# Altium schematic sheet MCU152A_XDS110_MCU.SchDoc
size 431 x 279 mm; Date: Not shown in title block; ApprovedBy: Not shown in title block; CheckedBy: Not shown in title block; Author: Not shown in title block; CompanyName: Not shown in title block; Engineer: Not shown in title block; Organization: Not shown in title block; Address1: Not shown in title block; Address2: Not shown in title block; Address3: Not shown in title block; Address4: Not shown in title block; DocumentNumber: 7; Revision: Use project parameter SCH_Rev; SheetNumber: 7; SheetTotal: 8; PageSetup: Record=PageOptions|CenterHorizontal=True|CenterVertical=True|PrintScale=1.00|XCorrection=1.00|YCorrection=1.00|PrintKind=0|BorderSize=5000000|LeftOffset=0|BottomOffset=0|Orientation=2|PaperLength=1000|PaperWidth=1000|Scale=100|PaperSource=15|PrintQuality=600|MediaType=1|DitherType=10|PaperKind=Letter|PrintScaleMode=1; CurrentTime: Not shown in title block; CurrentDate: Not shown in title block; Time: Not shown in title block; DocumentFullPathAndName: Not shown in title block; DocumentName: Not shown in title block; ModifiedDate: Not shown in title block; ImagePath: Not shown in title block
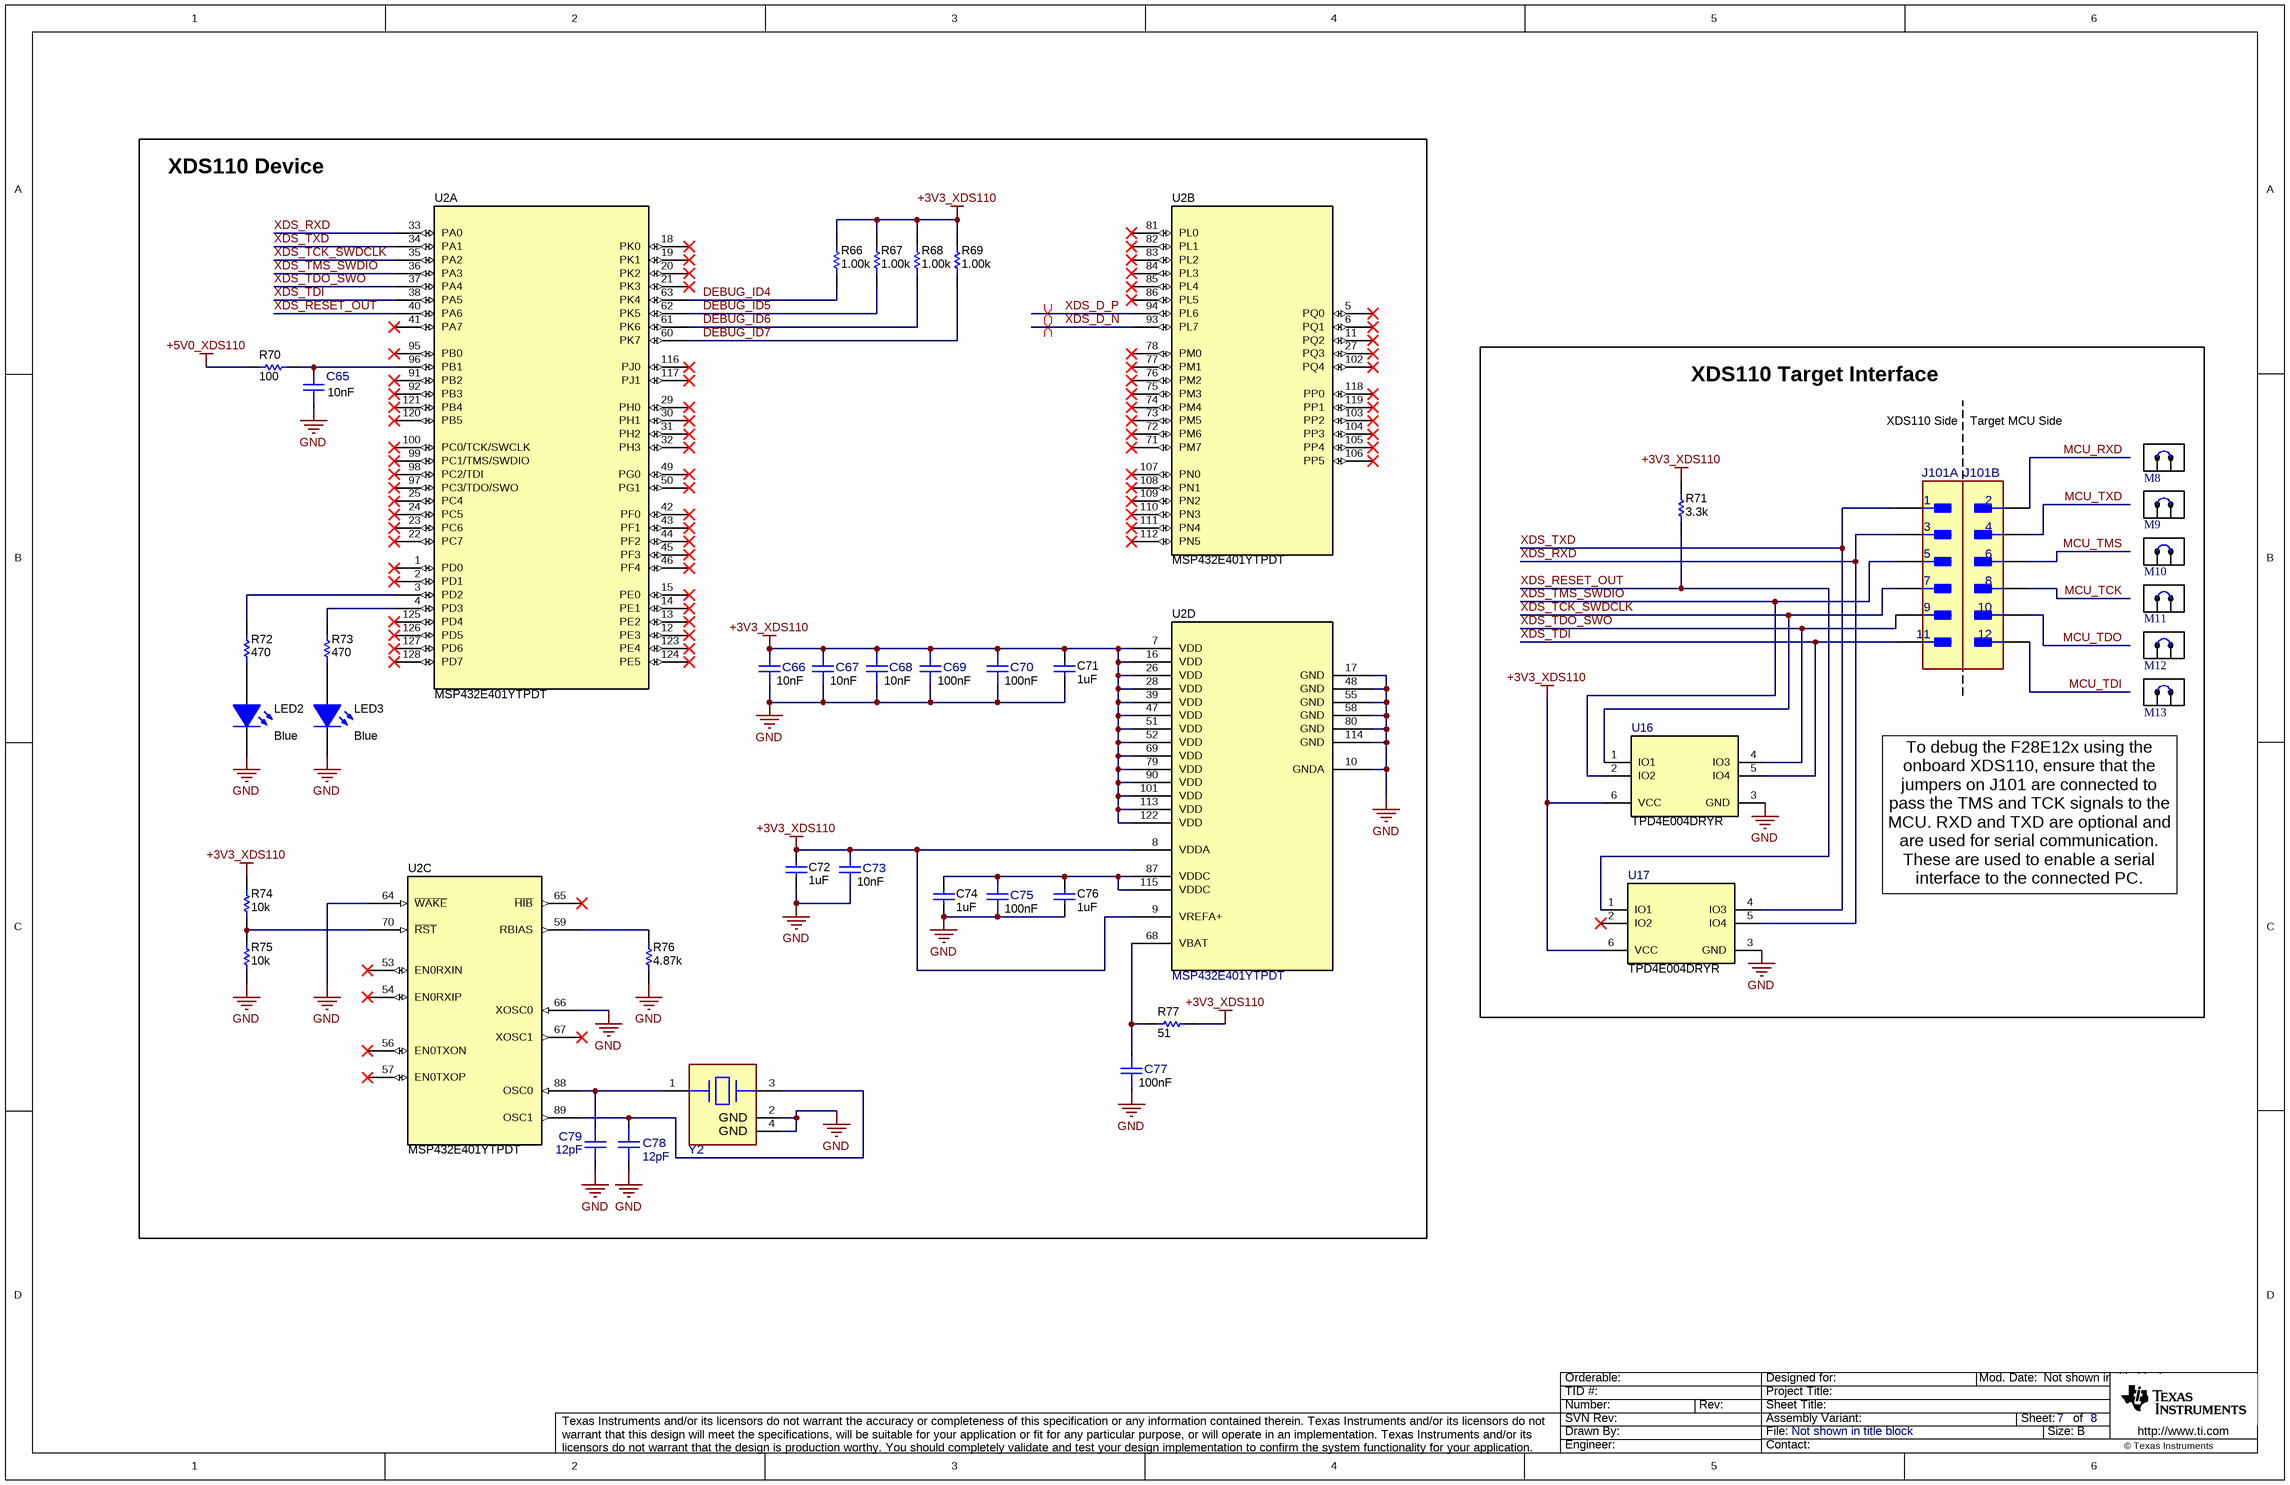
[diagram p0: MCU152A_XDS110_MCU.SchDoc]

## Parts
C65  Cap_F: 10nF  [FP-885012205050_0402-MFG]  (hidden comment: 885012205050)
C66  Cap_F: 10nF  [FP-885012205050_0402-MFG]  (hidden comment: 885012205050)
C67  Cap_F: 10nF  [FP-885012205050_0402-MFG]  (hidden comment: 885012205050)
C68  Cap_F: 10nF  [FP-885012205050_0402-MFG]  (hidden comment: 885012205050)
C69  Cap_F: 100nF  [FP-885012205018_0402-MFG]  (hidden comment: 885012205018)
C70  Cap_F: 100nF  [FP-885012205018_0402-MFG]  (hidden comment: 885012205018)
C71  ValueDisplayed: 1uF  [0402]  (hidden comment: 885012105012)
C72  ValueDisplayed: 1uF  [0402]  (hidden comment: 885012105012)
C73  Cap_F: 10nF  [FP-885012205050_0402-MFG]  (hidden comment: 885012205050)
C74  ValueDisplayed: 1uF  [0402]  (hidden comment: 885012105012)
C75  Cap_F: 100nF  [FP-885012205018_0402-MFG]  (hidden comment: 885012205018)
C76  ValueDisplayed: 1uF  [0402]  (hidden comment: 885012105012)
C77  Cap_F: 100nF  [FP-885012205018_0402-MFG]  (hidden comment: 885012205018)
C78  ValueDisplayed: 12pF  [FP-885392005127_0402-MFG]  (hidden comment: 885392005127)
C79  ValueDisplayed: 12pF  [FP-885392005127_0402-MFG]  (hidden comment: 885392005127)
J101  61301221121  [FP-61301221121_HDR12-MFG]  (value not drawn)  (parts A,B of 2)
LED2  value Blue  [WL-SMCW_Blue_0805]  (hidden comment: 150080BS75000)
LED3  value Blue  [WL-SMCW_Blue_0805]  (hidden comment: 150080BS75000)
M8  60900213421  [Wurth_60900213421]  (value not drawn)
M9  60900213421  [Wurth_60900213421]  (value not drawn)
M10  60900213421  [Wurth_60900213421]  (value not drawn)
M11  60900213421  [Wurth_60900213421]  (value not drawn)
M12  60900213421  [Wurth_60900213421]  (value not drawn)
M13  60900213421  [Wurth_60900213421]  (value not drawn)
R66  ValueDisplayed: 1.00k  [0402]  (hidden comment: CRCW04021K00FKED)
R67  ValueDisplayed: 1.00k  [0402]  (hidden comment: CRCW04021K00FKED)
R68  ValueDisplayed: 1.00k  [0402]  (hidden comment: CRCW04021K00FKED)
R69  ValueDisplayed: 1.00k  [0402]  (hidden comment: CRCW04021K00FKED)
R70  ValueDisplayed: 100  [0402]  (hidden comment: CRCW0402100RJNED)
R71  ValueDisplayed: 3.3k  [0402]  (hidden comment: CRCW04023K30JNED)
R72  ValueDisplayed: 470  [0402]  (hidden comment: RC0402FR-07470RL)
R73  ValueDisplayed: 470  [0402]  (hidden comment: RC0402FR-07470RL)
R74  ValueDisplayed: 10k  [0402]  (hidden comment: CRCW040210K0JNED)
R75  ValueDisplayed: 10k  [0402]  (hidden comment: CRCW040210K0JNED)
R76  ValueDisplayed: 4.87k  [0402]  (hidden comment: CRCW04024K87FKED)
R77  ValueDisplayed: 51  [0402]  (hidden comment: CRCW040251R0JNED)
U2  MSP432E401YTPDT  [PDT0128A]  (parts A,B,C,D of 4)
U16  TPD4E004DRYR  [DRY0006A]
U17  TPD4E004DRYR  [DRY0006A]
Y2  830064296  [FP-830064296_SMT4_3MM4_2MM7-MFG]  (value not drawn)

## Blocks framed on the sheet
XDS110 Device: C65-C79 LED2 LED3 R66-R70 R72-R77 U2 Y2
XDS110 Target Interface: J101 M8-M13 R71 U16 U17

## Nets
+3V3_XDS110: C66.2 C67.2 C68.2 C69.2 C70.2 C71.1 C72.1 C73.2 R66.2 R67.2 R68.2 R69.2 R71.2 R74.2 R77.2 U2.7(VDD) U2.8(VDDA) U2.9(VREFA+) U2.16(VDD) U2.26(VDD) U2.28(VDD) U2.39(VDD) U2.47(VDD) U2.51(VDD) U2.52(VDD) U2.69(VDD) U2.79(VDD) U2.90(VDD) U2.101(VDD) U2.113(VDD) U2.122(VDD) U16.6(VCC) U17.6(VCC)
+5V0_XDS110: R70.1
GND: C65.1 C66.1 C67.1 C68.1 C69.1 C70.1 C71.2 C72.2 C73.1 C74.2 C75.1 C76.2 C77.1 C78.2 C79.2 LED2.1(K) LED3.1(K) R75.1 R76.1 U2.10(GNDA) U2.17(GND) U2.48(GND) U2.55(GND) U2.58(GND) U2.64(~{WAKE}) U2.66(XOSC0) U2.80(GND) U2.114(GND) U16.3(GND) U17.3(GND) Y2.2(GND) Y2.4(GND)
DEBUG_ID4: R66.1 U2.63(PK4)
DEBUG_ID5: R67.1 U2.62(PK5)
DEBUG_ID6: R68.1 U2.61(PK6)
DEBUG_ID7: R69.1 U2.60(PK7)
MCU_RXD: J101.2
MCU_TCK: J101.8
MCU_TDI: J101.12
MCU_TDO: J101.10
MCU_TMS: J101.6
MCU_TXD: J101.4
XDS_D_N: U2.93(PL7)
XDS_D_P: U2.94(PL6)
XDS_RESET_OUT: R71.1 U2.40(PA6) U17.1(IO1)
XDS_RXD: J101.3 U2.33(PA0) U17.5(IO4)
XDS_TCK_SWDCLK: J101.7 U2.35(PA2) U16.1(IO1)
XDS_TDI: J101.11 U2.38(PA5) U16.5(IO4)
XDS_TDO_SWO: J101.9 U2.37(PA4) U16.4(IO3)
XDS_TMS_SWDIO: J101.5 U2.36(PA3) U16.2(IO2)
XDS_TXD: J101.1 U2.34(PA1) U17.4(IO3)
NetC65_2: C65.2 R70.2 U2.96(PB1)
NetC74_1: C74.1 C75.2 C76.1 U2.87(VDDC) U2.115(VDDC)
NetC77_2: C77.2 R77.1 U2.68(VBAT)
NetC78_1: C78.1 U2.89(OSC1) Y2.3(2_Crystal)
NetC79_1: C79.1 U2.88(OSC0) Y2.1(1_Crystal)
NetLED2_2: LED2.2(A) R72.1
NetLED3_2: LED3.2(A) R73.1
NetR72_2: R72.2 U2.3(PD2)
NetR73_2: R73.2 U2.4(PD3)
NetR74_1: R74.1 R75.2 U2.70(~{RST})
NetR76_2: R76.2 U2.59(RBIAS)

Not connected (* = marked no-connect by the designer): U2 1(PD0)* 2(PD1)* 5(PQ0)* 6(PQ1)* 11(PQ2)* 12(PE3)* 13(PE2)* 14(PE1)* 15(PE0)* 18(PK0)* 19(PK1)* 20(PK2)* 21(PK3)* 22(PC7)* 23(PC6)* 24(PC5)* 25(PC4)* 27(PQ3)* 29(PH0)* 30(PH1)* 31(PH2)* 32(PH3)* 41(PA7)* 42(PF0)* 43(PF1)* 44(PF2)* 45(PF3)* 46(PF4)* 49(PG0)* 50(PG1)* 53(EN0RXIN)* 54(EN0RXIP)* 56(EN0TXON)* 57(EN0TXOP)* 65(~{HIB})* 67(XOSC1)* 71(PM7)* 72(PM6)* 73(PM5)* 74(PM4)* 75(PM3)* 76(PM2)* 77(PM1)* 78(PM0)* 81(PL0)* 82(PL1)* 83(PL2)* 84(PL3)* 85(PL4)* 86(PL5)* 91(PB2)* 92(PB3)* 95(PB0)* 97(PC3/TDO/SWO)* 98(PC2/TDI)* 99(PC1/TMS/SWDIO)* 100(PC0/TCK/SWCLK)* 102(PQ4)* 103(PP2)* 104(PP3)* 105(PP4)* 106(PP5)* 107(PN0)* 108(PN1)* 109(PN2)* 110(PN3)* 111(PN4)* 112(PN5)* 116(PJ0)* 117(PJ1)* 118(PP0)* 119(PP1)* 120(PB5)* 121(PB4)* 123(PE4)* 124(PE5)* 125(PD4)* 126(PD5)* 127(PD6)* 128(PD7)*; U17 2(IO2)*

## Layout directives
differential pair: XDS_D_N, XDS_D_P

## Notes on the sheet
- XDS110 Side
- Target MCU Side
- (near M13) To debug the F28E12x using the onboard XDS110, ensure that the jumpers on J101 are connected to pass the TMS and TCK signals to the MCU. RXD and TXD are optional and are used for serial communication. These are used to enable a serial interface to the connected PC.
- Drawn By:
- SVN Rev:
- Number:
- TID #:
- Orderable:
- Rev:
- Sheet Title:
- File:
- Project Title:
- Designed for:
- Assembly Variant:
- Mod. Date:
- Sheet:
- Size:
- of
- B
- http://www.ti.com
- Texas Instruments and/or its licensors do not warrant the accuracy or completeness of this specification or any information contained therein. Texas Instruments and/or its licensors do not warrant that this design will meet the specifications, will be suitable for your application or fit for any particular purpose, or will operate in an implementation. Texas Instruments and/or its licensors do not warrant that the design is production worthy. You should completely validate and test your design implementation to confirm the system functionality for your application.
- Engineer:
- Contact:
- © Texas Instruments

## Library data of the parts
C65-C68 C73 = CMP-0090363-1: 10000pF ±10% 25V Ceramic Capacitor X7R 0402 (1005 Metric); Manufacturer: Wurth Electronics; SizeZ_mm: 0.55mm; AEC Qualified: No; Value: 10nF; TempCo: 15%; Digikey Description: CAP CER 10000PF 25V X7R 0402; RoHS: TRUE; PackageReference: 0402; Lead Free: Yes; ValueDisplayed: 10000pF; datasheet: https://www.we-online.com/catalog/datasheet/885012205050.pdf; Datasheet Path: datasheets/Cap-885012205050.pdf; Mouser Part Number: 710-885012205050; Operating Temperature Range: -55°C to +125°C; Supplier 1: Digikey; Part Number: 885012205050; ComponentLink1URL: https://www.we-online.com/catalog/datasheet/885012205050.pdf; Tolerance_%: 10%; Digikey Part Number: 732-7545-1-ND; Temperature Characteristic: X7R; Supplier Part Number 1: 732-7545-1-ND; helpURL: https://upverter.com/upn/revision/f9df62cb48b9b255/; PartNumber: 885012205050; Supplier 2: Mouser; ComponentLink1Description: Datasheet; Supplier Part Number 2: 710-885012205050; VDC_V: 25V
C69 C70 C75 C77 = CMP-0090362-1: 0.1µF ±10% 10V Ceramic Capacitor X7R 0402 (1005 Metric); Manufacturer: Wurth Electronics; AEC Qualified: No; Value: 100nF; SizeZ_mm: 0.55mm; ValueDisplayed: 100000pF; TempCo: 15%; RoHS: TRUE; Tolerance_%: 10%; datasheet: https://www.we-online.com/catalog/datasheet/885012205018.pdf; Lead Free: Yes; Operating Temperature Range: -55°C to +125°C; ComponentLink1Description: Datasheet; Digikey Description: CAP CER 0.1UF 10V X7R 0402; Supplier Part Number 1: 732-7513-1-ND; Supplier 2: Mouser; Mouser Part Number: 710-885012205018; Digikey Part Number: 732-7513-1-ND; Temperature Characteristic: X7R; Supplier 1: Digikey; Datasheet Path: datasheets/Cap-885012205018.pdf; ComponentLink1URL: https://www.we-online.com/catalog/datasheet/885012205018.pdf; VDC_V: 10V; Supplier Part Number 2: 710-885012205018; PackageReference: 0402; PartNumber: 885012205018; Part Number: 885012205018; helpURL: https://upverter.com/upn/revision/1acbe355db19639d/
C71 C72 C74 C76 = CMP-0064924-2: CAP, CERM, 1 uF, 10 V,+/- 20%, X5R, 0402; Manufacturer: Wurth Elektronik; Polarized: N; Value: 1uF; U/M: EA; Cap_F: 1µF; Value1: Unknown; VDC_V: 10V; TaMin_C: -55°C; TaMax_C: 85°C; SizeArea_mm2: 0.5; SizeAreaWB_mm2: 3; SizeX_mm: 1; SizeZ_mm: 0.6; AEC Category: Q200; CompType: Capacitor; PartNumber: 885012105012; PackageReference: 0402; RoHS: Y; Tolerance_%: 20%; Value2: 10V; MountType: SMT; Technology: Ceramic; TempCo: X5R; Cap_Case: 0402; SizeY_mm: 0.5; Published: 2008-06-19; Publisher: Texas Instruments; LatestRevisionDate: 2017-06-05; ComponentLink1Description: Datasheet link; ComponentLink1URL: http://katalog.we-online.de/pbs/datasheet/885012105012.pdf; Supplier 1: Digi-Key; Supplier Part Number 1: 732-7489-1-ND; Supplier 2: Newark; Supplier Part Number 2: 75Y5997; Supplier 3: Mouser; Supplier Part Number 3: 710-885012105012; AEC Qualified: N; AEC Grade: N/A
C78 C79 = CMP-0124909-1: 12 pF ±2% 50V Ceramic Capacitor C0G, NP0 0402 (1005 Metric); Manufacturer: Wurth; AEC Qualified: No; SizeZ_mm: 0.55mm; TempCo: 30ppm/°C; Value: 12pF; Cap_F: 12pF; PackageReference: 0402; PartNumber: 885392005127; RoHS: TRUE; Supplier 1: Digikey; Supplier 2: Mouser; Supplier Part Number 1: 732-885392005127CT-ND; Supplier Part Number 2: 710-885392005127; Tolerance_%: 2%; VDC_V: 50V; Part Number: 885392005127; datasheet: https://www.we-online.com/components/products/datasheet/885392005127.pdf; Datasheet Date: 2020-04-15; Datasheet Path: datasheets/Cap-885392005127.pdf; Datasheet Version: 001.000; Digikey Description: WCAP-CSRF HIGH FREQUENCY MLCC SM; Digikey Part Number: 732-885392005127CT-ND; helpURL: https://upverter.com/upn/revision/f0bec071446ecf6a/; Lead Free: Yes; Mouser Description: WCAP-CSRF High Frequency MLCC; Mouser Part Number: 710-885392005127; Operating Temperature Range: -55°C to +125°C; Temperature Characteristic: NP0; ComponentLink1Description: Datasheet; ComponentLink1URL: https://www.we-online.com/components/products/datasheet/885392005127.pdf
J101 = CMP-0092423-1: THT Vertical Pin Header WR-PHD, Pitch 2.54 mm, Dual Row, 12 pins; Manufacturer: Wurth Electronics; Is Female: no; DUT-Pitch_mm: 2.54mm; Row_Count: 2; Current_A: 3A; Voltage_V: 250V; Conn Gender: Male; Conn Orientation: Straight; SizeZ_mm: 8.89mm; ContactFinish: Gold; Supplier Part Number 2: 710-61301221121; Supplier 1: Digikey; Digikey Description: CONN HEADER VERT 12POS 2.54MM; AEC Qualified: No; Part Number: 61301221121; ComponentLink1Description: Datasheet; ComponentLink1URL: https://www.we-online.com/catalog/datasheet/61301221121.pdf; Supplier Part Number 1: 732-5297-ND; Datasheet Path: datasheets/Conn-61301221121.pdf; Mouser Part Number: 710-61301221121; Supplier 2: Mouser; datasheet: https://www.we-online.com/catalog/datasheet/61301221121.pdf; PinCount: 12; PartNumber: 61301221121; Operating Temperature Range: -40°C to +105°C; helpURL: https://upverter.com/upn/revision/392edd98517a0c19/; RoHS: TRUE; Lead Free: Yes; Digikey Part Number: 732-5297-ND; PackageReference: HDR12
LED2 LED3 = CMP-0002959-3: LED, Blue, SMD; Manufacturer: Wurth Elektronik; Vf_V: 3.2V; Value1: 0.105W; Angle: 140; Type: InGaN; Power_TotalModule: 105mW; Tjmax_C: 85°C; Vr_V: 5V; Io_A: 20mA; ComponentLink1URL: http://katalog.we-online.de/led/datasheet/150080BS75000.pdf; RoHS: Y; Color: Blue; MountType: SMT; Value2: 3.2V; ComponentLink1Description: Datasheet link; CompType: LED; PartNumber: 150080BS75000; PackageReference: LED_0805
M8-M13 = CMP-0003761-2: Shunt, 2.54mm, Gold, Black; Manufacturer: Wurth Elektronik; ComponentLink1URL: http://katalog.we-online.de/em/datasheet/60900213421.pdf; Supplier Part Number 2: 16T0609; Supplier 3: Mouser; Supplier 1: Digi-Key; CompType: Shunt; PackageReference: Shunt, 2.54mm, Black; RoHS: Y; Supplier Part Number 1: 732-2678-ND; Supplier Part Number 3: 710-60900213421; Supplier 2: Newark; MountType: N/A; PartNumber: 60900213421; ComponentLink1Description: Datasheet Link; ClassName: Shunt
R66-R69 = CMP-0026071-3: RES, 1.00 k, 1%, 0.063 W, AEC-Q200 Grade 0, 0402; Manufacturer: Vishay-Dale; Power_W: 63mW; TempCo: 100 ppm/C; Value_Code: 1k00; Value: 1.00k; EIA_Code: E96; Res_ohm: 1k; SizeX_mm: 1; SizeY_mm: 0.5; SizeZ_mm: 0.6; Value2: 0.063W; AEC Qualified: Y; VDC_V: 50V; AEC Category: Q200; AEC Grade: 0; Supplier Part Number 2: 52K6545; Supplier 2: Newark; Supplier Part Number 3: 71-CRCW0402-1.0K-E3; Supplier 3: Mouser; RoHS: E; Value1: 1%; MountType: SMT; Supplier 1: Digi-Key; PackageReference: 0402; Tolerance_%: 1%; SizeArea_mm2: 0.5; CompType: Resistor; PartNumber: CRCW04021K00FKED; ComponentLink1Description: Datasheet link; Supplier Part Number 1: 541-1.00KLCT-ND; Technology: Thick Film; ComponentLink1URL: http://www.vishay.com/docs/20035/dcrcwe3.pdf
R70 = CMP-0026824-3: RES, 100, 5%, 0.063 W, AEC-Q200 Grade 0, 0402; Manufacturer: Vishay-Dale; Value: 100; Value_Code: 100R; Power_W: 63mW; Value2: 0.063W; VDC_V: 50V; TempCo: 200 ppm/C; SizeArea_mm2: 0.5; SizeX_mm: 1; SizeZ_mm: 0.6; EIA_Code: E24; AEC Category: Q200; AEC Qualified: Y; AEC Grade: 0; CompType: Resistor; PartNumber: CRCW0402100RJNED; PackageReference: 0402; RoHS: E; Res_ohm: 100; Tolerance_%: 5%; Value1: 5%; MountType: SMT; Technology: Thick Film; SizeY_mm: 0.5; ComponentLink1Description: Datasheet link; ComponentLink1URL: http://www.vishay.com/docs/20035/dcrcwe3.pdf; Supplier 1: Digi-Key; Supplier Part Number 1: 541-100JCT-ND; Supplier 2: Newark; Supplier Part Number 2: 59M6700; Supplier 3: Mouser; Supplier Part Number 3: 71-CRCW0402J-100-E3
R71 = CMP-0026918-5: RES, 3.3 k, 5%, 0.063 W, AEC-Q200 Grade 0, 0402; Manufacturer: Vishay-Dale; Value: 3.3k; Value_Code: 3k30; Power_W: 63mW; Value2: 0.063W; VDC_V: 50V; TempCo: 200 ppm/C; SizeArea_mm2: 0.5; SizeX_mm: 1; SizeZ_mm: 0.6; EIA_Code: E24; AEC Category: Q200; AEC Qualified: Y; AEC Grade: 0; CompType: Resistor; PartNumber: CRCW04023K30JNED; PackageReference: 0402; RoHS: E; Res_ohm: 3.3k; Tolerance_%: 5%; Value1: 5%; MountType: SMT; Technology: Thick Film; SizeY_mm: 0.5; ComponentLink1Description: Datasheet link; ComponentLink1URL: http://www.vishay.com/docs/20035/dcrcwe3.pdf; Supplier 1: Digi-Key; Supplier Part Number 1: 541-3.3KJCT-ND; Supplier 2: Newark; Supplier Part Number 2: 59M6723; Supplier 3: Mouser; Supplier Part Number 3: 71-CRCW0402J-3.3K-E3
R72 R73 = CMP-0026736-1: RES, 470, 1%, 0.063 W, 0402; Manufacturer: Yageo America; Power_W: 63mW; TempCo: 100 ppm/C; Value_Code: 470R; U/M: EA; Value: 470; SizeX_mm: 1; SizeY_mm: 0.5; SizeZ_mm: 0.6; Value2: 0.063W; AEC Qualified: N; VDC_V: 50V; AEC Category: Q200; ComponentLink1URL: http://www.yageo.com/documents/recent/PYu-RC_Group_51_RoHS_L_04.pdf; Supplier Part Number 2: 67R9940; Publisher: Texas Instruments; Supplier 2: Newark; Supplier Part Number 3: 603-RC0402FR-07470RL; Supplier 3: Mouser; Published: 2008-06-26; RoHS: Y; Value1: 1%; MountType: SMT; Supplier 1: Digi-Key; PackageReference: 0402; Tolerance_%: 1%; Res_ohm: 470; SizeArea_mm2: 0.5; CompType: Resistor; LatestRevisionDate: 2017-03-09; PartNumber: RC0402FR-07470RL; ComponentLink1Description: Datasheet link; AEC Grade: N/A; Supplier Part Number 1: 311-470LRCT-ND; Technology: Thick Film
R74 R75 = CMP-0026825-5: RES, 10 k, 5%, 0.063 W, AEC-Q200 Grade 0, 0402; Manufacturer: Vishay-Dale; Value: 10k; Value_Code: 10k0; Power_W: 63mW; Value2: 0.063W; VDC_V: 50V; TempCo: 200 ppm/C; SizeArea_mm2: 0.5; SizeX_mm: 1; SizeZ_mm: 0.6; EIA_Code: E24; AEC Category: Q200; AEC Qualified: Y; AEC Grade: 0; CompType: Resistor; PartNumber: CRCW040210K0JNED; PackageReference: 0402; RoHS: E; Res_ohm: 10k; Tolerance_%: 5%; Value1: 5%; MountType: SMT; Technology: Thick Film; SizeY_mm: 0.5; ComponentLink1Description: Datasheet link; ComponentLink1URL: http://www.vishay.com/docs/20035/dcrcwe3.pdf; Supplier 1: Digi-Key; Supplier Part Number 1: 541-10KJCT-ND; Supplier 2: Newark; Supplier Part Number 2: 59M6696; Supplier 3: Mouser; Supplier Part Number 3: 71-CRCW0402J-10K-E3
R76 = CMP-0026413-2: RES, 4.87 k, 1%, 0.063 W, AEC-Q200 Grade 0, 0402; Manufacturer: Vishay-Dale; Value: 4.87k; Value_Code: 4k87; Power_W: 63mW; Value2: 0.063W; VDC_V: 50V; TempCo: 100 ppm/C; SizeArea_mm2: 0.5; SizeX_mm: 1; SizeZ_mm: 0.6; EIA_Code: E96; AEC Category: Q200; AEC Qualified: Y; AEC Grade: 0; CompType: Resistor; PartNumber: CRCW04024K87FKED; PackageReference: 0402; RoHS: E; Res_ohm: 4.87k; Tolerance_%: 1%; Value1: 1%; MountType: SMT; Technology: Thick Film; SizeY_mm: 0.5; ComponentLink1Description: Datasheet link; ComponentLink1URL: http://www.vishay.com/docs/20035/dcrcwe3.pdf; Supplier 1: Digi-Key; Supplier Part Number 1: 541-4.87KLCT-ND; Supplier 2: Newark; Supplier Part Number 2: 52K7047; Supplier 3: Mouser; Supplier Part Number 3: 71-CRCW0402-4.87K-E3
R77 = CMP-0026946-3: RES, 51, 5%, 0.063 W, AEC-Q200 Grade 0, 0402; Manufacturer: Vishay-Dale; Value: 51; Value_Code: 51R0; Power_W: 63mW; Value2: 0.063W; VDC_V: 50V; TempCo: 200 ppm/C; SizeArea_mm2: 0.5; SizeX_mm: 1; SizeZ_mm: 0.6; EIA_Code: E24; AEC Category: Q200; AEC Qualified: Y; AEC Grade: 0; CompType: Resistor; PartNumber: CRCW040251R0JNED; PackageReference: 0402; RoHS: E; Res_ohm: 51; Tolerance_%: 5%; Value1: 5%; MountType: SMT; Technology: Thick Film; SizeY_mm: 0.5; ComponentLink1Description: Datasheet link; ComponentLink1URL: http://www.vishay.com/docs/20035/dcrcwe3.pdf; Supplier 1: Digi-Key; Supplier Part Number 1: 541-51JCT-ND; Supplier 2: Newark; Supplier Part Number 2: 72M6804; Supplier 3: Mouser; Supplier Part Number 3: 71-CRCW0402J-51-E3
U2 = CMP-0077953-1: MSP432E401YTPDT, PDT0128A (TQFP-128); Alternate PartNumber: MSP432E401YTPDTR; Alternate Manufacturer: Texas Instruments; SizeAreaWB_mm2: 324; SizeZ_mm: 1.2; SizeX_mm: 16; SizeArea_mm2: 256; CompType: IC; AEC Qualified: N; AEC Category: Q200; ComponentLink1URL: http://www.ti.com/lit/ds/symlink/tm4c129encpdt.pdf; PackageDescription: TQFP-128; MountType: SMT; ComponentLink2URL: TBD; ComponentLink2Description: Product Folder; Manufacturer: Texas Instruments; PackageReference: PDT0128A; SizeY_mm: 16; PartNumber: MSP432E401YTPDT; ComponentLink1Description: Datasheet Link
U16 U17 = CMP-0043115-3: 4-Channel ESD Protection Array for High-Speed Data Interfaces, DRY0006A (USON-6); Manufacturer: Texas Instruments; IO Leakage Current(nA): 1; USB High Speed: TRUE; IO Capacitance(Typ)(pF): 1.6; Eco-Plan: Green (RoHS & no Sb/Br); IEC 61000-4-2 Contact(+/- kV): 8; Breakdown Voltage(Min)(V): 6; IEC 61000-4-2 Air-Gap(+/- kV): 12; AEC Category: Q200; AEC Qualified: N; CompType: IC; SizeAreaWB_mm2: 4.9; SizeArea_mm2: 1.45; SizeX_mm: 1.0; SizeZ_mm: 0.6; Rating: Catalog; ComponentLink3URL: http://www.ti.com/product/tpd4e004/datasheet; ComponentLink1Description: Datasheet Link; ComponentLink2URL: http://www.ti.com/product/tpd4e004; ComponentLink1URL: http://www.ti.com/lit/ds/symlink/tpd4e004.pdf; PackageDescription: USON-6; 1394 / Firewire: TRUE; PackageReference: DRY0006A; ComponentLink3Description: Online Datasheet; ComponentLink2Description: Product Folder; Serial ATA / eSATA: TRUE; PartNumber: TPD4E004DRYR; MountType: SMT; RoHS: Y; SizeY_mm: 1.45; Operating Temperature Range: -40 to 85 C
Y2 = CMP-0094478-1: Crystal 16 MHz ±20ppm Crystal 8pF 70 Ohms 4-SMD, No Lead; Manufacturer: Wurth; SizeZ_mm: 0.8mm; Frequency_Fixed: 16MHz; Esr: 70; Datasheet Path: datasheets/Crys-830064296.pdf; ComponentLink1URL: https://www.we-online.com/catalog/datasheet/830064296.pdf; AEC Qualified: No; datasheet: https://www.we-online.com/catalog/datasheet/830064296.pdf; Digikey Description: CRYSTAL 16.0000MHZ 8PF SMD; RoHS: TRUE; ComponentLink1Description: Datasheet; Mouser Part Number: 710-830064296; Supplier Part Number 2: 710-830064296; Frequency Tolerance: 20ppm; Tolerance_%: 20ppm; helpURL: https://upverter.com/upn/revision/3ee1bd9ebef5a5fe/; Operating Temperature Range: -10°C to +70°C; Digikey Part Number: 732-830064296CT-ND; Supplier 2: Mouser; PartNumber: 830064296; Frequency Stability: 20ppm; Series: CFPX-180; PackageReference: SMT4_3MM4_2MM7; Supplier 1: Digikey; Load Capacitance: 8pF; Part Number: 830064296; Supplier Part Number 1: 732-830064296CT-ND; Lead Free: Yes